# Altium schematic sheet 05-SERIAL&USB.SchDoc
size A3
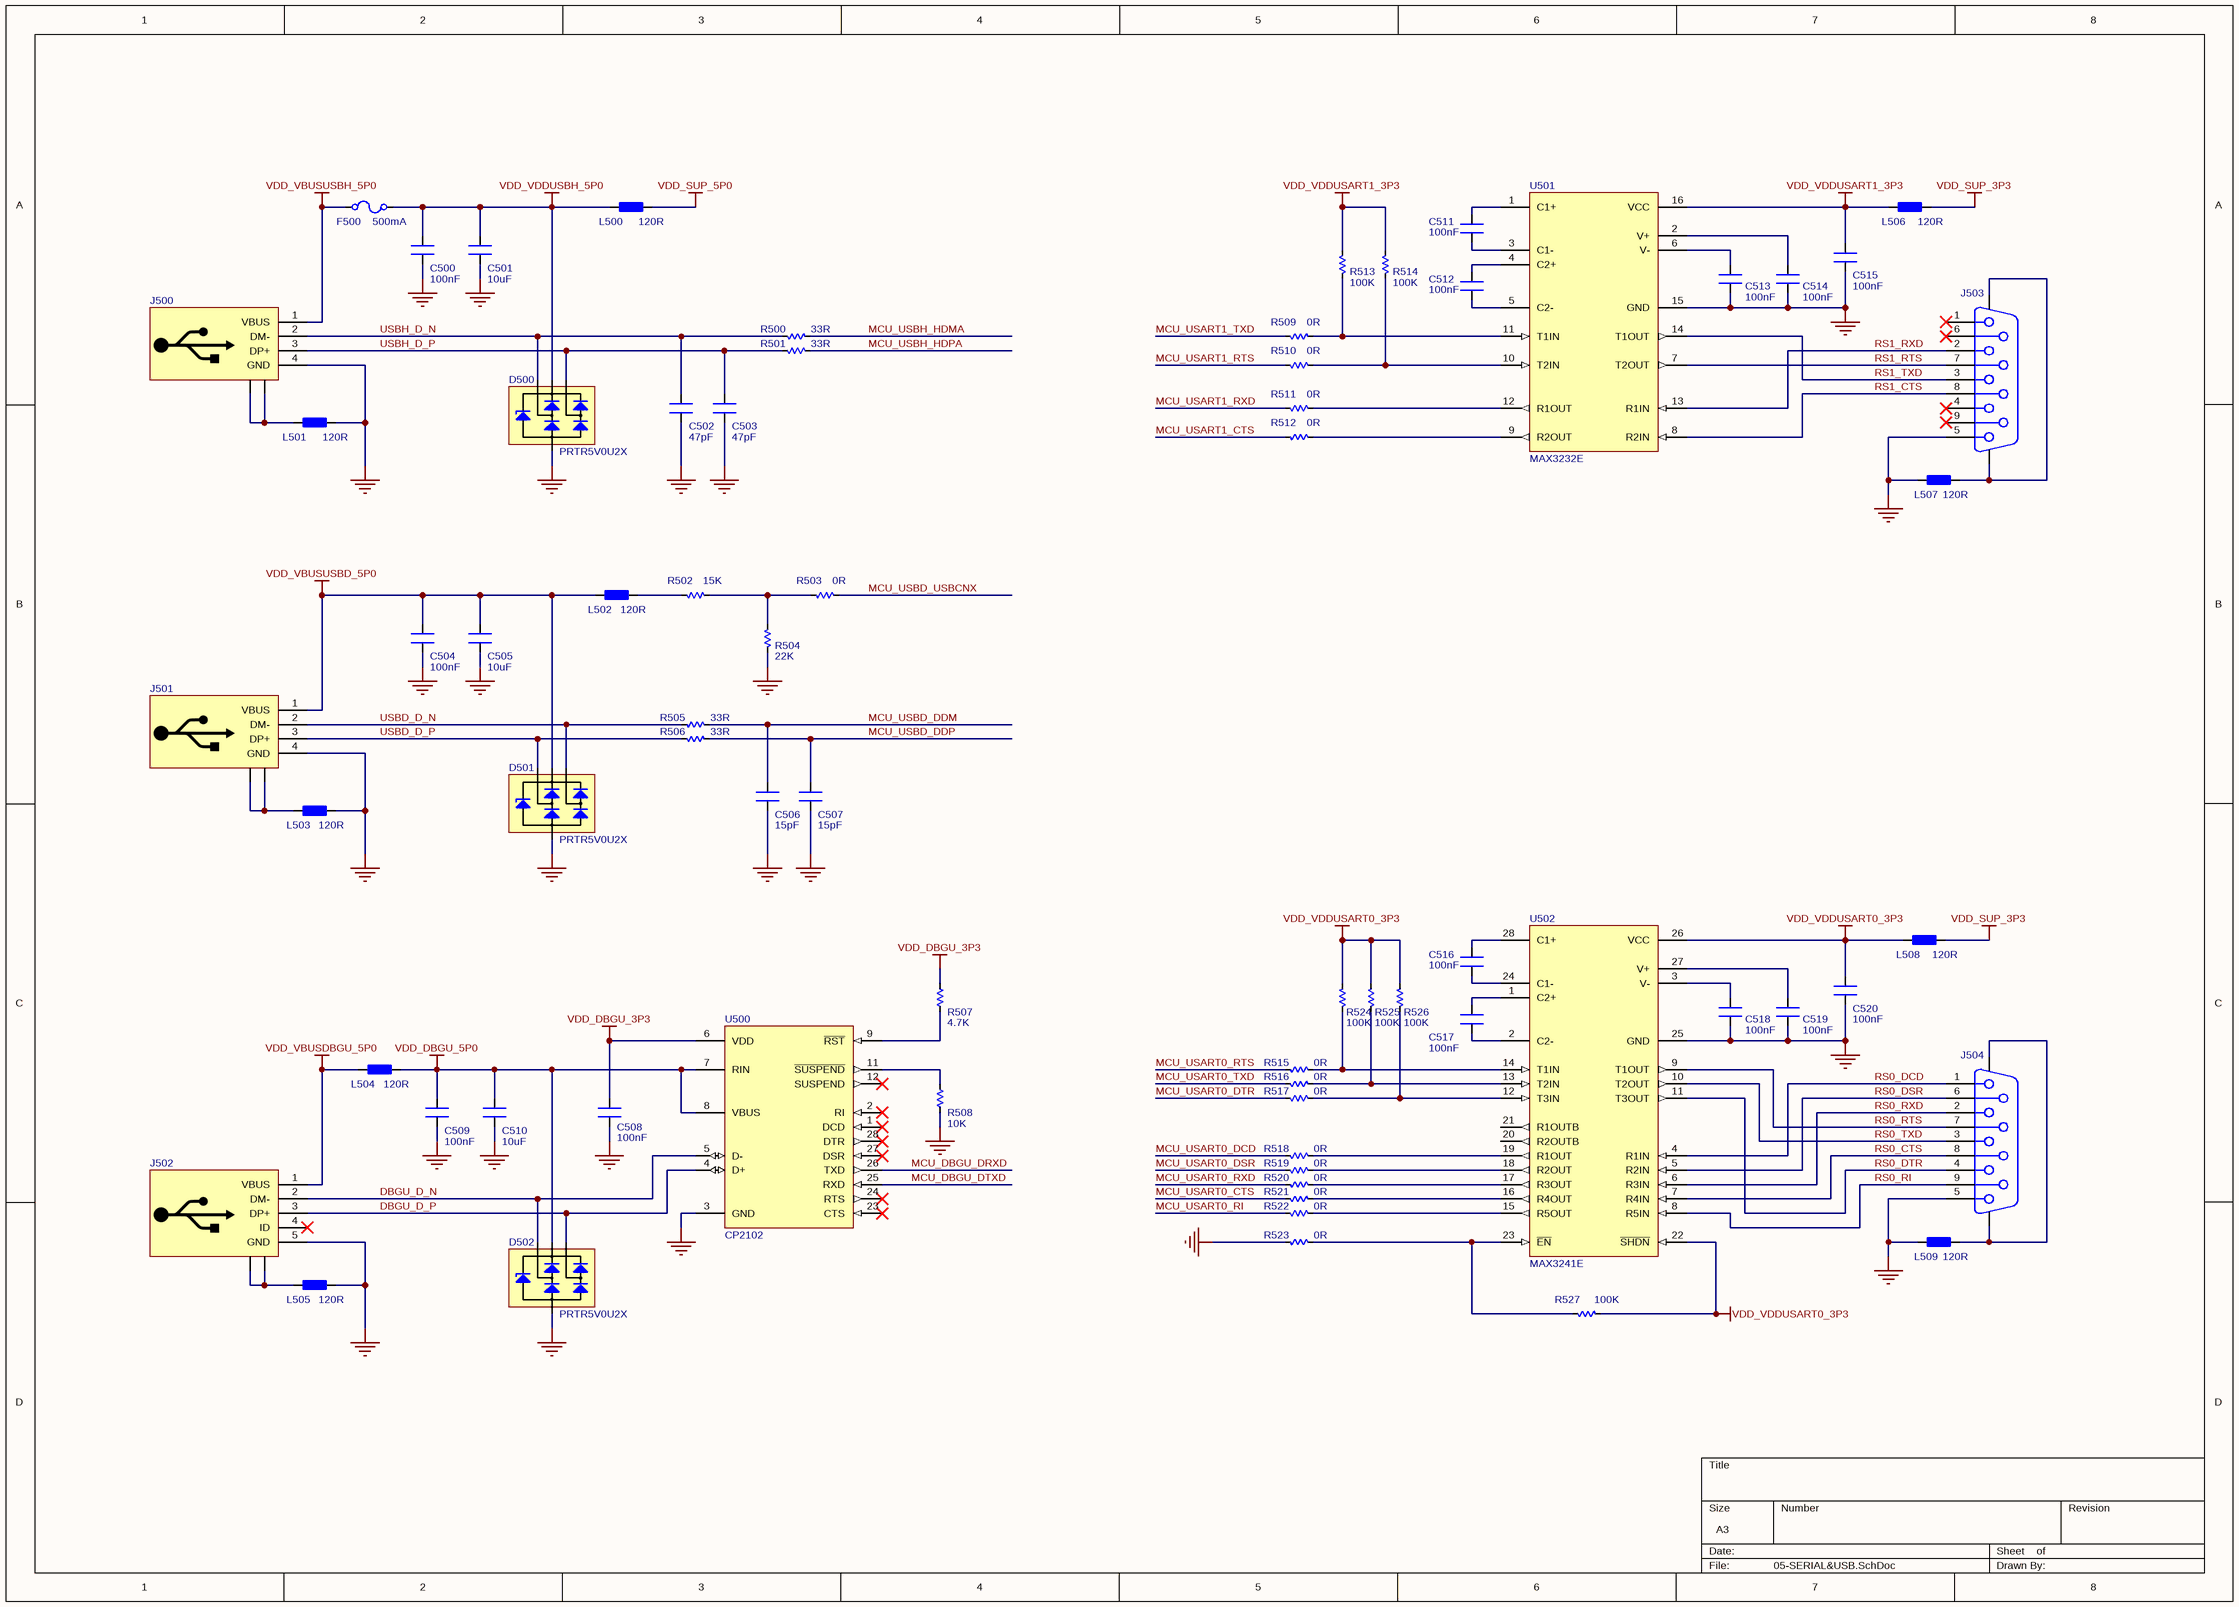
[diagram p0: 05-SERIAL&USB.SchDoc]

## Parts
C500  value 100nF  [CN-SMD-0603]  (hidden comment: Capacitor)
C501  value 10uF  [CN-SMD-0603]  (hidden comment: Capacitor)
C502  value 47pF  [CN-SMD-0603]  (hidden comment: Capacitor)
C503  value 47pF  [CN-SMD-0603]  (hidden comment: Capacitor)
C504  value 100nF  [CN-SMD-0603]  (hidden comment: Capacitor)
C505  value 10uF  [CN-SMD-0603]  (hidden comment: Capacitor)
C506  value 15pF  [CN-SMD-0603]  (hidden comment: Capacitor)
C507  value 15pF  [CN-SMD-0603]  (hidden comment: Capacitor)
C508  value 100nF  [CN-SMD-0603]  (hidden comment: Capacitor)
C509  value 100nF  [CN-SMD-0603]  (hidden comment: Capacitor)
C510  value 10uF  [CN-SMD-0603]  (hidden comment: Capacitor)
C511  value 100nF  [CN-SMD-0603]  (hidden comment: Capacitor)
C512  value 100nF  [CN-SMD-0603]  (hidden comment: Capacitor)
C513  value 100nF  [CN-SMD-0603]  (hidden comment: Capacitor)
C514  value 100nF  [CN-SMD-0603]  (hidden comment: Capacitor)
C515  value 100nF  [CN-SMD-0603]  (hidden comment: Capacitor)
C516  value 100nF  [CN-SMD-0603]  (hidden comment: Capacitor)
C517  value 100nF  [CN-SMD-0603]  (hidden comment: Capacitor)
C518  value 100nF  [CN-SMD-0603]  (hidden comment: Capacitor)
C519  value 100nF  [CN-SMD-0603]  (hidden comment: Capacitor)
C520  value 100nF  [CN-SMD-0603]  (hidden comment: Capacitor)
D500  PRTR5V0U2X  [SOT190P237X120-4N]
D501  PRTR5V0U2X  [SOT190P237X120-4N]
D502  PRTR5V0U2X  [SOT190P237X120-4N]
F500  500mA  [FUSE-SMD-1812]
J500  USB-4  [USB_A_F_DIP_RA]  (value not drawn)
J501  USB-4  [USB_B_F_DIP]  (value not drawn)
J502  USB-5  [USB_micro-B_F_SMD-2]  (value not drawn)
J503  DB9  [DB9_DIP_M]  (value not drawn)
J504  DB9  [DB9_DIP_M]  (value not drawn)
L500  value 120R  [L-SMD-0603]  (hidden comment: Ferrite bead)
L501  value 120R  [L-SMD-0603]  (hidden comment: Ferrite bead)
L502  value 120R  [L-SMD-0603]  (hidden comment: Ferrite bead)
L503  value 120R  [L-SMD-0603]  (hidden comment: Ferrite bead)
L504  value 120R  [L-SMD-0603]  (hidden comment: Ferrite bead)
L505  value 120R  [L-SMD-0603]  (hidden comment: Ferrite bead)
L506  value 120R  [L-SMD-0603]  (hidden comment: Ferrite bead)
L507  value 120R  [L-SMD-0603]  (hidden comment: Ferrite bead)
L508  value 120R  [L-SMD-0603]  (hidden comment: Ferrite bead)
L509  value 120R  [L-SMD-0603]  (hidden comment: Ferrite bead)
R500  value 33R  [RES-SMD-0603]  (hidden comment: Resistor)
R501  value 33R  [RES-SMD-0603]  (hidden comment: Resistor)
R502  value 15K  [RES-SMD-0603]  (hidden comment: Resistor)
R503  value 0R  [RES-SMD-0603]  (hidden comment: Resistor)
R504  value 22K  [RES-SMD-0603]  (hidden comment: Resistor)
R505  value 33R  [RES-SMD-0603]  (hidden comment: Resistor)
R506  value 33R  [RES-SMD-0603]  (hidden comment: Resistor)
R507  value 4.7K  [RES-SMD-0603]  (hidden comment: R)
R508  value 10K  [RES-SMD-0603]  (hidden comment: R)
R509  value 0R  [RES-SMD-0603]  (hidden comment: Resistor)
R510  value 0R  [RES-SMD-0603]  (hidden comment: Resistor)
R511  value 0R  [RES-SMD-0603]  (hidden comment: Resistor)
R512  value 0R  [RES-SMD-0603]  (hidden comment: Resistor)
R513  value 100K  [RES-SMD-0603]  (hidden comment: Resistor)
R514  value 100K  [RES-SMD-0603]  (hidden comment: Resistor)
R515  value 0R  [RES-SMD-0603]  (hidden comment: Resistor)
R516  value 0R  [RES-SMD-0603]  (hidden comment: Resistor)
R517  value 0R  [RES-SMD-0603]  (hidden comment: Resistor)
R518  value 0R  [RES-SMD-0603]  (hidden comment: Resistor)
R519  value 0R  [RES-SMD-0603]  (hidden comment: Resistor)
R520  value 0R  [RES-SMD-0603]  (hidden comment: Resistor)
R521  value 0R  [RES-SMD-0603]  (hidden comment: Resistor)
R522  value 0R  [RES-SMD-0603]  (hidden comment: Resistor)
R523  value 0R  [RES-SMD-0603]  (hidden comment: Resistor)
R524  value 100K  [RES-SMD-0603]  (hidden comment: Resistor)
R525  value 100K  [RES-SMD-0603]  (hidden comment: Resistor)
R526  value 100K  [RES-SMD-0603]  (hidden comment: Resistor)
R527  value 100K  [RES-SMD-0603]  (hidden comment: Resistor)
U500  CP2102  [QFN50P500X500X100_HS-29N]
U501  MAX3232E  [TSSOP65P640X120-16N]
U502  MAX3241E  [SSOP65P780X200-28N]

## Nets
GND: C500.1 C501.1 C502.1 C503.1 C504.1 C505.1 C506.1 C507.1 C508.1 C509.1 C510.1 C513.1 C514.1 C515.1 C518.1 C519.1 C520.1 D500.1(GND) D501.1(GND) D502.1(GND) J500.4(GND) J501.4(GND) J502.5(GND) J503.5(GND) J504.5(GND) L501.1 L503.2 L505.2 L507.1 L509.1 R504.2 R508.1 R523.2 U500.3(GND) U501.15(GND) U502.25(GND)
VDD_DBGU_3P3: C508.2 R507.2 U500.6(VDD)
VDD_DBGU_5P0: C509.2 C510.2 D502.4(VDD) L504.2 U500.7(RIN) U500.8(VBUS)
VDD_SUP_3P3: L506.2 L508.2
VDD_SUP_5P0: L500.2
VDD_VBUSDBGU_5P0: J502.1(VBUS) L504.1
VDD_VBUSUSBD_5P0: C504.2 C505.2 D501.4(VDD) J501.1(VBUS) L502.1
VDD_VBUSUSBH_5P0: F500.1 J500.1(VBUS)
VDD_VDDUSART0_3P3: C520.2 L508.1 R524.1 R525.1 R526.1 R527.1 U502.22(~{SHDN}) U502.26(VCC)
VDD_VDDUSART1_3P3: C515.2 L506.1 R513.1 R514.1 U501.16(VCC)
VDD_VDDUSBH_5P0: C500.2 C501.2 D500.4(VDD) F500.2 L500.1
DBGU_D_N: D502.2 J502.2(DM-) U500.5(D-)
DBGU_D_P: D502.3 J502.3(DP+) U500.4(D+)
MCU_DBGU_DRXD: U500.26(TXD)
MCU_DBGU_DTXD: U500.25(RXD)
MCU_USART0_CTS: R521.2
MCU_USART0_DCD: R518.2
MCU_USART0_DSR: R519.2
MCU_USART0_DTR: R517.2
MCU_USART0_RI: R522.2
MCU_USART0_RTS: R515.2
MCU_USART0_RXD: R520.2
MCU_USART0_TXD: R516.2
MCU_USART1_CTS: R512.2
MCU_USART1_RTS: R510.2
MCU_USART1_RXD: R511.2
MCU_USART1_TXD: R509.2
MCU_USBD_DDM: C506.2 R505.1
MCU_USBD_DDP: C507.2 R506.1
MCU_USBD_USBCNX: R503.1
MCU_USBH_HDMA: R500.1
MCU_USBH_HDPA: R501.1
RS0_CTS: J504.8(CTS) U502.7(R4IN)
RS0_DCD: J504.1(DCD) U502.4(R1IN)
RS0_DSR: J504.6(DSR) U502.5(R2IN)
RS0_DTR: J504.4(DTR) U502.11(T3OUT)
RS0_RI: J504.9(RI) U502.8(R5IN)
RS0_RTS: J504.7(RTS) U502.9(T1OUT)
RS0_RXD: J504.2(RXD) U502.6(R3IN)
RS0_TXD: J504.3(TXD) U502.10(T2OUT)
RS1_CTS: J503.8(CTS) U501.8(R2IN)
RS1_RTS: J503.7(RTS) U501.7(T2OUT)
RS1_RXD: J503.2(RXD) U501.13(R1IN)
RS1_TXD: J503.3(TXD) U501.14(T1OUT)
USBD_D_N: D501.3 J501.2(DM-) R505.2
USBD_D_P: D501.2 J501.3(DP+) R506.2
USBH_D_N: C502.2 D500.2 J500.2(DM-) R500.2
USBH_D_P: C503.2 D500.3 J500.3(DP+) R501.2
NetC511_1: C511.1 U501.3(C1-)
NetC511_2: C511.2 U501.1(C1+)
NetC512_1: C512.1 U501.5(C2-)
NetC512_2: C512.2 U501.4(C2+)
NetC513_2: C513.2 U501.6(V-)
NetC514_2: C514.2 U501.2(V+)
NetC516_1: C516.1 U502.24(C1-)
NetC516_2: C516.2 U502.28(C1+)
NetC517_1: C517.1 U502.2(C2-)
NetC517_2: C517.2 U502.1(C2+)
NetC518_2: C518.2 U502.3(V-)
NetC519_2: C519.2 U502.27(V+)
NetJ500_0: J500.0 L501.2
NetJ501_0: J501.0 L503.1
NetJ502_0: J502.0 L505.1
NetJ503_10: J503.10 J503.11 L507.2
NetJ504_10: J504.10 J504.11 L509.2
NetL502_2: L502.2 R502.2
NetR502_1: R502.1 R503.2 R504.1
NetR507_1: R507.1 U500.9(~{RST})
NetR508_2: R508.2 U500.11(~{SUSPEND})
NetR509_1: R509.1 R513.2 U501.11(T1IN)
NetR510_1: R510.1 R514.2 U501.10(T2IN)
NetR511_1: R511.1 U501.12(R1OUT)
NetR512_1: R512.1 U501.9(R2OUT)
NetR515_1: R515.1 R524.2 U502.14(T1IN)
NetR516_1: R516.1 R525.2 U502.13(T2IN)
NetR517_1: R517.1 R526.2 U502.12(T3IN)
NetR518_1: R518.1 U502.19(R1OUT)
NetR519_1: R519.1 U502.18(R2OUT)
NetR520_1: R520.1 U502.17(R3OUT)
NetR521_1: R521.1 U502.16(R4OUT)
NetR522_1: R522.1 U502.15(R5OUT)
NetR523_1: R523.1 R527.2 U502.23(~{EN})

Not connected (* = marked no-connect by the designer): J502 4(ID)*; J503 1(DCD)* 4(DTR)* 6(DSR)* 9(RI)*; U500 1(DCD)* 2(RI)* 12(SUSPEND)* 23(CTS)* 24(RTS)* 27(DSR)* 28(DTR)*; U502 20(R2OUTB) 21(R1OUTB)

## Library data of the parts
C500 C504 C508 C509 C511-C520 = Cap: Ceramic Capacitor SMD 0603 100nF ±20% 10V
C501 C505 C510 = Cap: Ceramic Capacitor SMD 0603 10uF ±20% 10V
C502 C503 = Cap: Ceramic Capacitor SMD 0603 47pF ±20% 10V
C506 C507 = Cap: Ceramic Capacitor SMD 0603 15pF ±20% 10V
D500-D502 = PRTR5V0U2X: Ultra low capacitance double rail-to-rail ESD protection diode
F500 = FUSE: Fuse SMD1812 500mA
J500 = USB-4: USB Male/Female type A
J501 = USB-4: USB Male/Female type B
J502 = USB-5: USB Female type B
J503 J504 = DB9: DB-9 Female port
L500-L509 = Ferrite bead: Ferrite bead SMD 0603 120 Ohm @100MHz
R500 R501 R505 R506 = Res: Resistor SMD 0603 33R 1% 0.1W
R502 = Res: Resistor SMD 0603 15K 1% 0.1W
R503 R509-R512 R515-R523 = Res: Resistor SMD 0603 0R 1% 0.1W
R504 = Res: Resistor SMD 0603 22K 1% 0.1W
R507 = Res: Resistor SMD 0603 4.7K 1% 0.1W
R508 = Res: Resistor SMD 0603 10K 1% 0.1W
R513 R514 R524-R527 = Res: Resistor SMD 0603 100K 1% 0.1W
U500 = CP2102: Single chip USB-to-UART Bridge
U501 = MAX3232E: Maxim Integrated ±15kV ESD-Protected, Down to 10nA, 3.0V to 5.5V, Up to 1Mbps, True RS-232 Transceivers
U502 = MAX3241E: Maxim Integrated ±15kV ESD-Protected, Down to 10nA, 3.0V to 5.5V, Up to 1Mbps, True RS-232 Transceivers